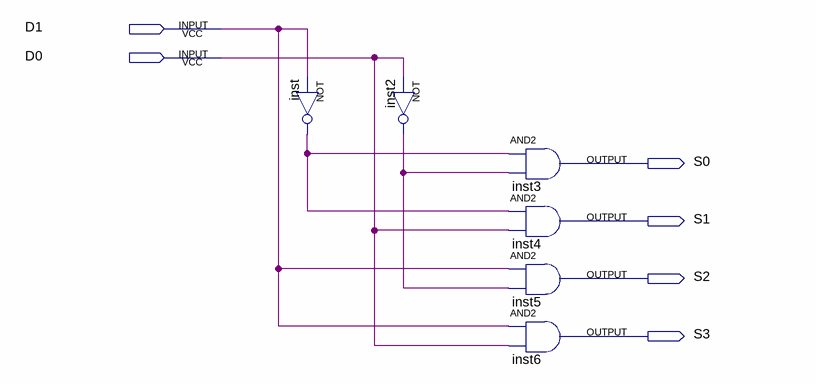
[diagram p0: schematic sheet]
// Quartus schematic Decodificador.bdf as structural Verilog: 6 symbols, 6 pins
module Decodificador (
  input  D1,
  input  D0,
  output S0,
  output S1,
  output S2,
  output S3
);

  wire inst2_out, inst_out;

  not inst (inst_out, D1);
  not inst2 (inst2_out, D0);
  and inst3 (S0, inst_out, inst2_out);
  and inst4 (S1, inst_out, D0);
  and inst5 (S2, D1, inst2_out);
  and inst6 (S3, D1, D0);
endmodule
